# EAGLE design rega_bis (EAGLE 9.5.0)
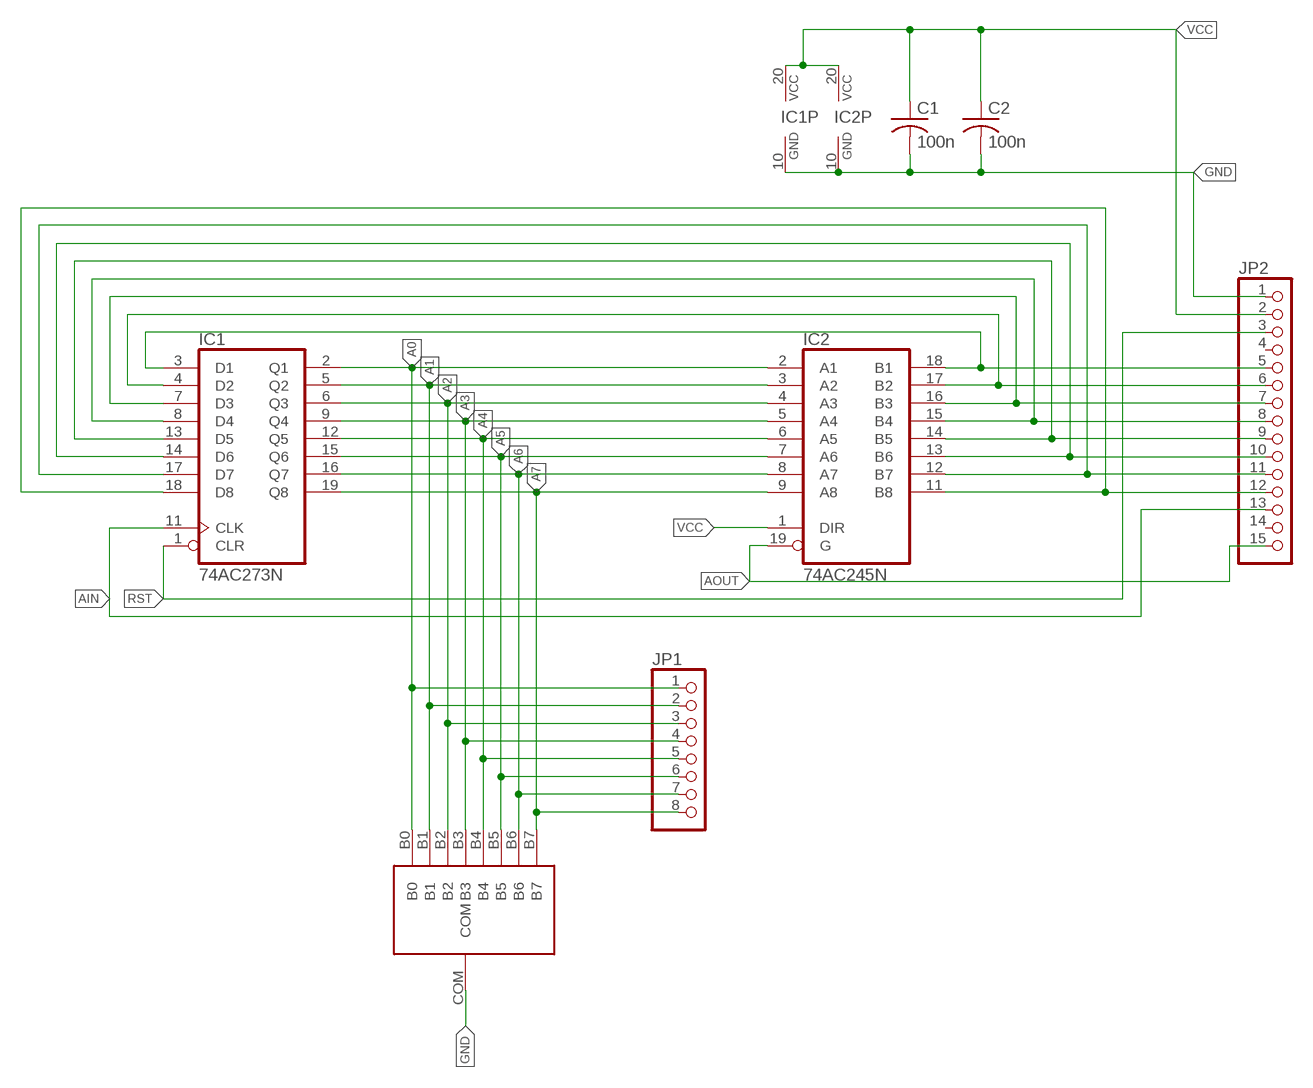
[diagram p0: schematic, sheet 1]

## Parts
C1  100n  C-US050-025X075  [C050-025X075]
C2  100n  C-US050-025X075  [C050-025X075]
IC1  74AC273N  [DIL20]
IC2  74AC245N  [DIL20]
JP1  PINHD-1X8  [1X08]
JP2  PINHD-1X15/90  [1X15/90]
U$1  LEDEDGEGRAPH  [LEDEDGEGRAPH]

## Nets
A0: IC1.2(Q1) IC2.2(A1) JP1.1 U$1.B0
A1: IC1.5(Q2) IC2.3(A2) JP1.2 U$1.B1
A2: IC1.6(Q3) IC2.4(A3) JP1.3 U$1.B2
A3: IC1.9(Q4) IC2.5(A4) JP1.4 U$1.B3
A4: IC1.12(Q5) IC2.6(A5) JP1.5 U$1.B4
A5: IC1.15(Q6) IC2.7(A6) JP1.6 U$1.B5
A6: IC1.16(Q7) IC2.8(A7) JP1.7 U$1.B6
A7: IC1.19(Q8) IC2.9(A8) JP1.8 U$1.B7
AIN: IC1.11(CLK) JP2.13
AOUT: IC2.19(G) JP2.15
GND: C1.2 C2.2 IC1.10(GND) IC2.10(GND) JP2.1 U$1.COM
N$12: IC1.8(D4) IC2.15(B4) JP2.8
N$13: IC1.13(D5) IC2.14(B5) JP2.9
N$14: IC1.14(D6) IC2.13(B6) JP2.10
N$15: IC1.17(D7) IC2.12(B7) JP2.11
N$16: IC1.18(D8) IC2.11(B8) JP2.12
RST: IC1.1(CLR) JP2.3
VCC: C1.1 C2.1 IC1.20(VCC) IC2.1(DIR) IC2.20(VCC) JP2.2
W0: IC1.3(D1) IC2.18(B1) JP2.5
W1: IC1.4(D2) IC2.17(B2) JP2.6
W2: IC1.7(D3) IC2.16(B3) JP2.7
Unconnected: JP2.4 JP2.14

## Library data of the parts
C1 C2 = rcl:C-US: CAPACITOR, American symbol; SPICEPREFIX: C
IC1 = 74xx-eu:74*273: Octal D type FLIP FLOP, clear
IC2 = 74xx-eu:74*245: Octal BUS TRANSCEIVER, 3-state
JP1 = pinhead:PINHD-1X8: PIN HEADER
JP2 = pinhead:PINHD-1X15: PIN HEADER
U$1 = 7_segment_lib:LEDEDGEGRAPH

## Board
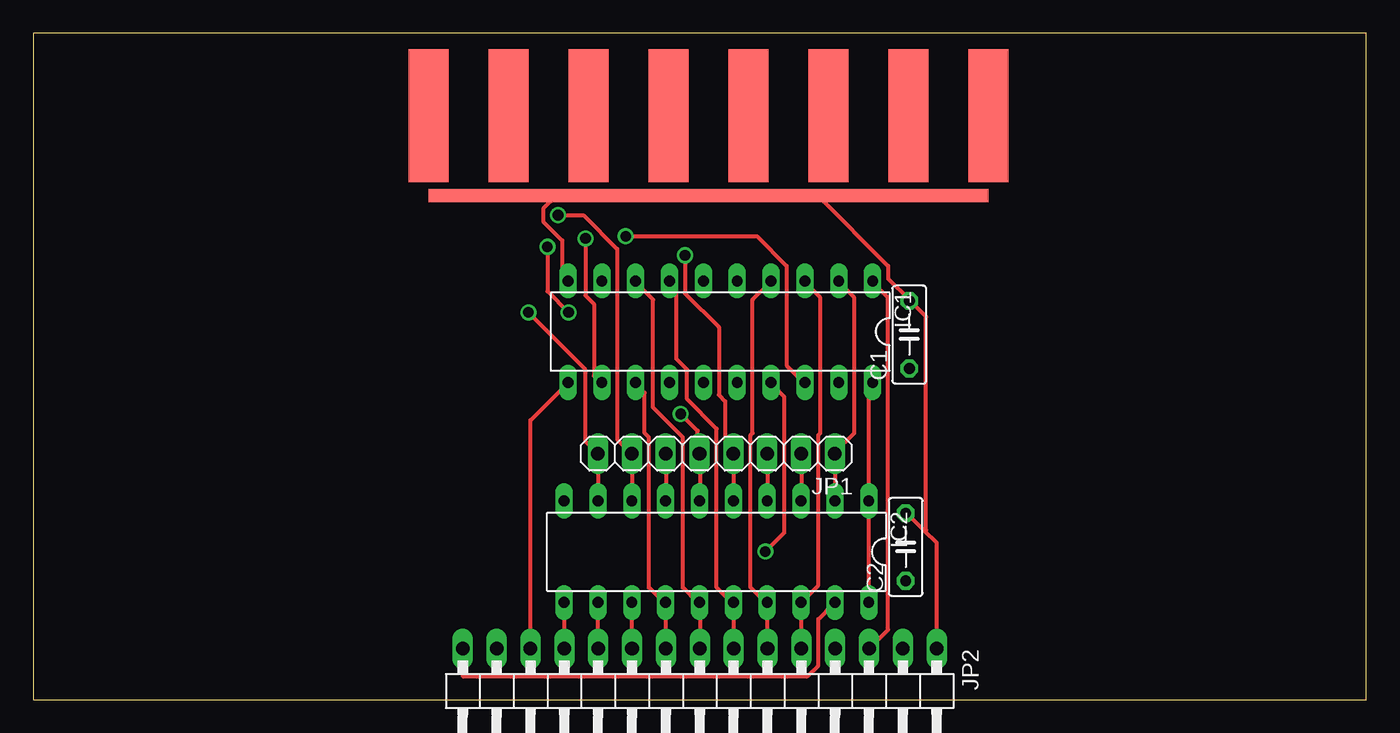
[diagram p1: board, top side]
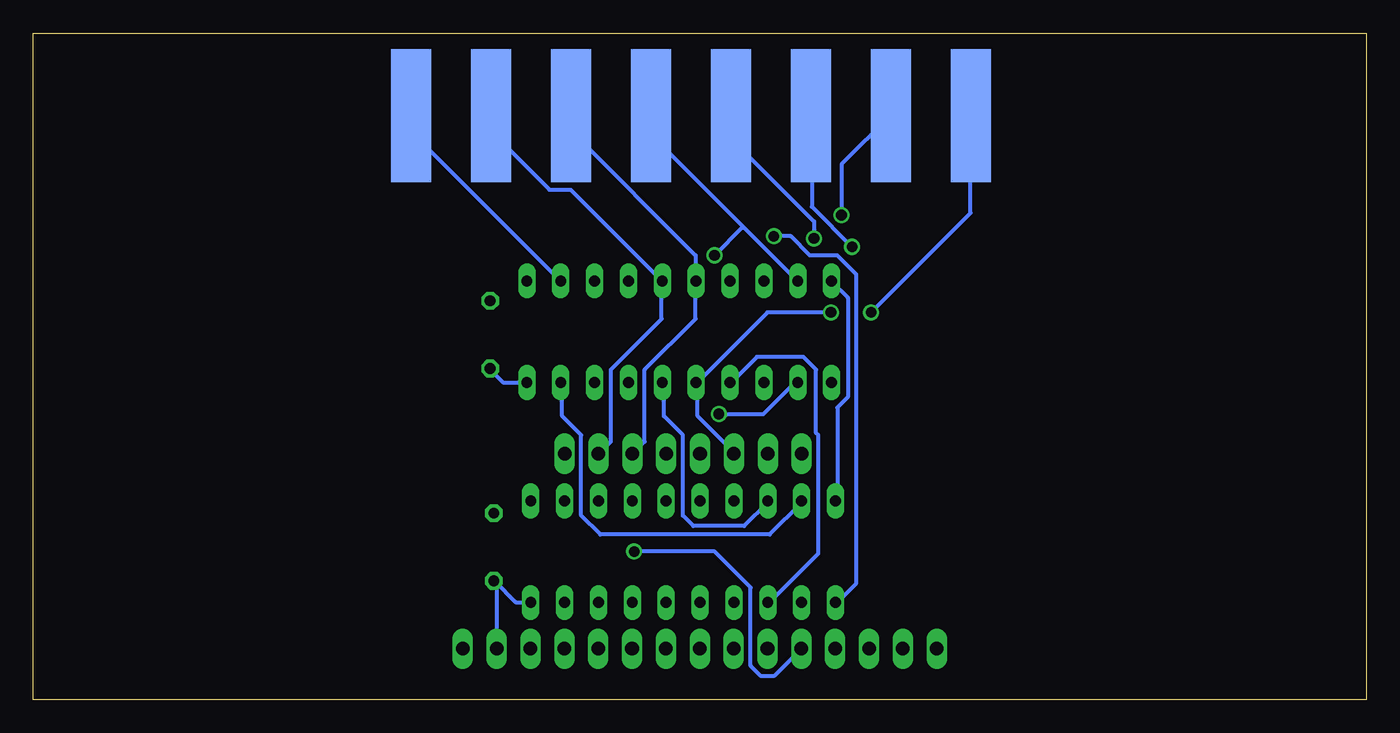
[diagram p2: board, bottom side, seen from below]

Size 100 x 50 mm. Coordinates in mm from the lower left corner, seen from the top.
Outline: 0,0 100,0 100,50 0,50 0,0
Copper layers (1*16): Top 0.035mm / dielectric 1.5mm / Bottom 0.035mm
Design rules "default *": minimum track width 12mil, minimum drill 0.8mm, track to track 12mil, track to pad 12mil, pad to pad 12mil, via to via 12mil, smd to smd 12mil, copper to edge 40mil, drill to drill 12mil, minimum pad ring 10mil, minimum via ring 8mil, stop-mask expansion 4mil, vias tented up to drill 0mil, thermal gap 10mil

### Footprints (pad centres in the part's own frame; a part is rotated, then mirrored left to right if it is on the bottom)
C050-025X075 = drill 0.813 octagon: 1 -2.54,0; 2 2.54,0
DIL20 = drill 0.813 long: 1 -11.43,-3.81; 2 -8.89,-3.81; 3 -6.35,-3.81; 4 -3.81,-3.81; 5 -1.27,-3.81; 6 1.27,-3.81; 7 3.81,-3.81; 8 6.35,-3.81; 9 8.89,-3.81; 10 11.43,-3.81; 11 11.43,3.81; 12 8.89,3.81; 13 6.35,3.81; 14 3.81,3.81; 15 1.27,3.81; 16 -1.27,3.81; 17 -3.81,3.81; 18 -6.35,3.81; 19 -8.89,3.81; 20 -11.43,3.81
1X08 = drill 1.016 long: 1 -8.89,0; 2 -6.35,0; 3 -3.81,0; 4 -1.27,0; 5 1.27,0; 6 3.81,0; 7 6.35,0; 8 8.89,0
1X15/90 = drill 1.016 long: 1 -17.78,-3.81; 2 -15.24,-3.81; 3 -12.7,-3.81; 4 -10.16,-3.81; 5 -7.62,-3.81; 6 -5.08,-3.81; 7 -2.54,-3.81; 8 0,-3.81; 9 2.54,-3.81; 10 5.08,-3.81; 11 7.62,-3.81; 12 10.16,-3.81; 13 12.7,-3.81; 14 15.24,-3.81; 15 17.78,-3.81
LEDEDGEGRAPH = smd 3 x 10: B0 0,0; B1 6,0; B2 12,0; B3 18,0; B4 24,0; B5 30,0; B6 36,0; B7 42,0 | smd 42 x 1 bottom: COM 21,-6 | smd 3 x 10 bottom: N0 0,0; N1 6,0; N2 12,0; N3 18,0; N4 24,0; N5 30,0; N6 36,0; N7 42,0

### Placement (x,y rotation side)
C1  65.72,27.39 90 top
C2  65.45,11.45 90 top
IC1  51.54,27.61 180 top
IC2  51.25,11.1 180 top
JP1  51.25,18.46 180 top
JP2  50,0 180 top
U$1  71.65,43.82 0 bottom

### Tracks (layer width: path | path; a pad name or v marks a point on that pad's centre or on a via)
A0
  Top 0.305: IC2.2 60.16,14.92 60.16,18.41 JP1.1 60.16,18.57 61.59,20 61.59,30.16 60.48,31.27 IC1.2
  Bottom 0.305: IC1.2 60.48,31.43 71.59,42.55 71.59,43.81 U$1.B0
A1
  Top 0.305: IC2.3 57.62,14.92 57.62,18.41 JP1.2
  Bottom 0.305: JP1.2 57.46,18.57 56.67,19.37 56.67,24.77 52.86,28.57 52.86,31.27 IC1.5 52.86,31.43 59.68,38.26 61.27,38.26 65.56,42.55 65.56,43.81 U$1.B1
A2
  Top 0.305: IC2.4 55.08,14.92 55.08,18.41 JP1.3
  Bottom 0.305: JP1.3 54.92,18.57 54.13,19.37 54.13,24.77 50.32,28.57 50.32,31.27 IC1.6 50.32,31.43 50.32,33.34 59.52,42.55 59.52,43.81 U$1.B2
A3  (via drill 0.8)
  Top 0.305: IC2.5 52.54,14.92 52.54,18.41 JP1.4 52.38,18.57 51.91,19.05 51.91,22.38 51.43,22.86 51.43,27.94 48.89,30.48 v48.89,33.34
  Bottom 0.305: 46.75,35.48 53.49,42.23 53.49,43.81 U$1.B3 | 46.75,35.48 42.7,31.43 IC1.9 | v48.89,33.34 46.83,35.4 46.75,35.48
A4  (via drill 0.8)
  Top 0.305: v48.57,21.43 49.84,20.16 49.84,18.57 JP1.5 50,18.41 50,14.92 IC2.6 | v41.43,34.61 41.43,30.32 42.06,29.69 42.06,24.29 42.54,23.81 IC1.12
  Bottom 0.305: v48.57,21.43 45.24,21.43 43.02,23.65 42.7,23.65 IC1.12 | v41.43,34.61 41.43,35.88 47.62,42.07 47.62,43.81 U$1.B4
A5  (via drill 0.8)
  Top 0.305: IC2.7 47.46,14.92 47.46,18.41 JP1.6 | v40.16,29.05 38.57,30.64 v38.57,33.97
  Bottom 0.305: JP1.6 47.46,18.57 50.16,21.27 50.16,23.65 IC1.15 50.16,23.81 44.92,29.05 v40.16,29.05 | v38.57,33.97 41.59,36.99 41.59,43.81 U$1.B5
A6  (via drill 0.8)
  Top 0.305: IC2.8 44.92,14.92 44.92,18.41 JP1.7 44.76,18.57 43.81,19.53 43.81,33.81 41.27,36.35 v39.36,36.35
  Bottom 0.305: IC1.16 52.7,23.65 52.7,21.27 51.27,19.84 51.27,13.81 50.48,13.02 46.67,13.02 44.92,14.76 IC2.8 | v39.36,36.35 39.36,40.16 35.71,43.81 U$1.B6
A7  (via drill 0.8)
  Top 0.305: IC2.9 42.38,14.92 42.38,18.41 JP1.8 42.22,18.57 41.43,19.37 41.43,24.77 v37.14,29.05
  Bottom 0.305: IC1.19 60.32,23.65 60.32,21.27 58.89,19.84 58.89,13.81 57.46,12.38 44.76,12.38 42.38,14.76 IC2.9 | v37.14,29.05 29.68,36.51 29.68,43.81 U$1.B7
AIN
  Top 0.305: JP2.13 37.3,20.95 40,23.65 IC1.11
AOUT
  Top 0.305: JP2.15 32.22,1.75 58.1,1.75 58.89,2.54 58.89,6.03 60,7.14 IC2.19
GND
  Top 0.305: 66.91,12.62 67.78,11.75 JP2.1 | 66.91,12.62 65.56,13.97 C2.2 | 66.91,12.62 66.99,12.7 66.99,28.73 65.88,29.84 C1.2 65.72,30 64.13,31.59 64.13,32.54 58.89,37.78 50.79,37.78 U$1.COM 50.63,37.78 39.2,37.78 38.25,36.83 38.25,35.88 39.68,34.45 39.68,31.75 40,31.43 IC1.10
  Bottom 0.305: IC2.10 39.68,14.92 39.68,21.91 38.89,22.7 38.89,30.16 40,31.27 IC1.10
N$12
  Top 0.305: IC1.8 45.24,31.27 46.51,30 46.51,21.91 48.73,19.68 48.73,8.41 49.84,7.3 IC2.15 50,7.14 JP2.8
N$13
  Top 0.305: JP2.9 47.46,7.14 IC2.14 47.3,7.3 46.19,8.41 46.19,19.68 45.87,20 45.87,23.02 45.24,23.65 IC1.13
N$14
  Top 0.305: JP2.10 44.92,7.14 IC2.13
  Bottom 0.305: IC1.14 47.62,23.81 45.71,25.72 42.22,25.72 41.27,24.77 41.27,20 41.11,19.84 41.11,10.95 44.76,7.3 IC2.13
N$15  (via drill 0.8)
  Top 0.305: JP2.11 42.38,7.14 IC2.12 | v54.92,11.11 56.35,12.54 56.35,22.7 55.4,23.65 IC1.17
  Bottom 0.305: v54.92,11.11 48.89,11.11 46.19,8.41 46.19,2.54 45.4,1.75 44.44,1.75 JP2.11
N$16  (via drill 0.8)
  Top 0.305: JP2.12 39.84,7.14 IC2.11 | v44.44,34.77 54.29,34.77 56.51,32.54 56.51,25.08 57.78,23.81 IC1.18
  Bottom 0.305: v44.44,34.77 43.17,34.77 41.74,33.34 39.68,33.34 38.25,31.91 38.25,8.73 39.68,7.3 IC2.11
RST
  Top 0.305: JP2.3 64.13,5.24 64.13,30.16 63.02,31.27 IC1.1
VCC
  Top 0.305: IC2.20 62.7,7.3 62.7,14.76 IC2.1 62.7,14.92 62.7,23.5 62.86,23.65 IC1.20
  Bottom 0.305: IC1.20 63.02,23.81 64.76,23.81 65.72,24.77 C1.1 | IC2.20 62.7,7.3 63.81,7.3 65.4,8.89 C2.1 65.24,8.57 JP2.2
W0
  Top 0.305: JP2.5 57.62,7.14 IC2.18 57.62,7.3 58.89,8.57 58.89,19.84 59.05,20 59.05,30.16 57.94,31.27 IC1.3
W1
  Top 0.305: JP2.6 55.08,7.14 IC2.17 54.92,7.3 53.81,8.41 53.81,19.84 53.97,20 53.97,30 55.24,31.27 IC1.4
W2
  Top 0.305: IC1.7 47.78,31.27 48.25,30.8 48.25,25.56 49.05,24.77 49.05,22.54 51.27,20.32 51.27,8.41 52.38,7.3 IC2.16 52.54,7.14 JP2.7